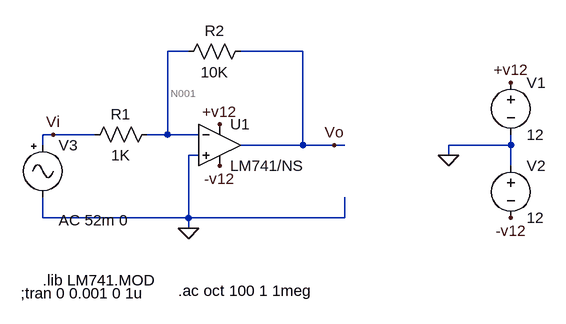
[diagram p0: schematic A2.asc]
A2.asc, the LTspice schematic file:
Version 4
SHEET 1 880 680
WIRE 112 0 80 0
WIRE 288 0 192 0
WIRE -96 128 -112 128
WIRE -32 128 -96 128
WIRE 80 128 80 0
WIRE 80 128 48 128
WIRE 128 128 80 128
WIRE -112 144 -112 128
WIRE 288 144 288 0
WIRE 288 144 192 144
WIRE 336 144 288 144
WIRE 352 144 336 144
WIRE 608 144 608 128
WIRE 608 144 512 144
WIRE 128 160 112 160
WIRE 512 160 512 144
WIRE 608 176 608 144
WIRE -112 256 -112 224
WIRE 112 256 112 160
WIRE 112 256 -112 256
WIRE 352 256 352 224
WIRE 352 256 112 256
WIRE 112 272 112 256
FLAG 512 160 0
FLAG 608 48 +v12
FLAG 160 112 +v12
FLAG 608 256 -v12
FLAG 160 176 -v12
FLAG 112 272 0
FLAG 336 144 Vo
FLAG -96 128 Vi
SYMBOL Opamps\\opamp2 160 80 R0
SYMATTR InstName U1
SYMATTR Value LM741/NS
SYMBOL res 208 -16 R90
WINDOW 0 0 56 VBottom 2
WINDOW 3 32 56 VTop 2
SYMATTR InstName R2
SYMATTR Value 10K
SYMBOL voltage 608 32 R0
WINDOW 123 0 0 Left 2
WINDOW 39 0 0 Left 2
SYMATTR InstName V1
SYMATTR Value 12
SYMBOL voltage 608 160 R0
WINDOW 123 0 0 Left 2
WINDOW 39 0 0 Left 2
SYMATTR InstName V2
SYMATTR Value 12
SYMBOL res 64 112 R90
WINDOW 0 0 56 VBottom 2
WINDOW 3 32 56 VTop 2
SYMATTR InstName R1
SYMATTR Value 1K
SYMBOL Misc\\signal -112 128 R0
WINDOW 123 24 132 Left 2
WINDOW 39 0 0 Left 2
SYMATTR InstName V3
SYMATTR Value ""
SYMATTR Value2 AC 52m 0
TEXT -112 352 Left 2 !.lib LM741.MOD
TEXT -146 372 Left 2 !;tran 0 0.001 0 1u
TEXT 96 368 Left 2 !.ac oct 100 1 1meg

The netlist it stands for:
* A2.asc
XU1 0 N001 +v12 -v12 Vo LM741/NS  ; pins In+ In- V+ V- OUT
R2 Vo N001 10K
V1 +v12 0 12
V2 0 -v12 12
R1 N001 Vi 1K
V3 Vi 0 AC 52m 0
.lib LM741.MOD
;tran 0 0.001 0 1u
.ac oct 100 1 1meg
.backanno
.end

* Results of the author's LTspice run, read from the files saved beside the schematic
* Operating Point, zero values left out:
*   V(n001) = 1 mV
*   V(-v12) = -12 V
*   V(+v12) = 12 V
*   V(vo) = 12.02 mV
*   I(R1) = 1 µA
*   I(R2) = 1.102 µA
*   I(V3) = 1 µA
*   I(V2) = -1.626 mA
*   I(V1) = -1.627 mA
*   Ix(u1:1) = 57.86 nA
*   Ix(u1:2) = 101.9 nA
*   Ix(u1:99) = 1.627 mA
*   Ix(u1:50) = -1.626 mA
*   Ix(u1:28) = -1.102 µA
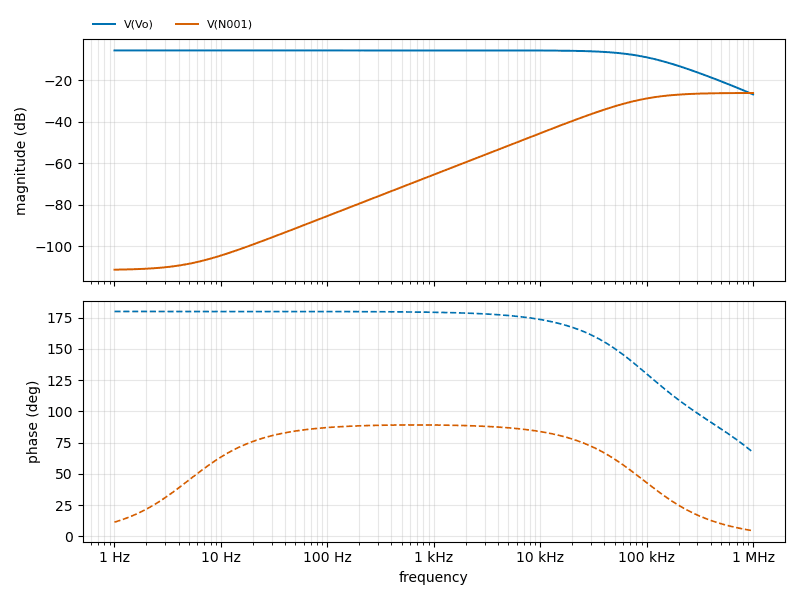
[diagram p1: AC Analysis of A2.asc, plotted from the saved traces]
* AC Analysis, 1 run:
*   V(Vo): -5.68 dB at 1 Hz, -26.91 dB at 1 MHz, peak -5.68 dB at 1 Hz, 3 dB below the peak at 93.2 kHz
*   V(N001): -111.38 dB at 1 Hz, -26.22 dB at 1 MHz, peak -26.22 dB at 932 kHz, 3 dB below the peak at 91.39 kHz